# Altium schematic sheet BV100011_ControlIRS485.SchDoc
size B
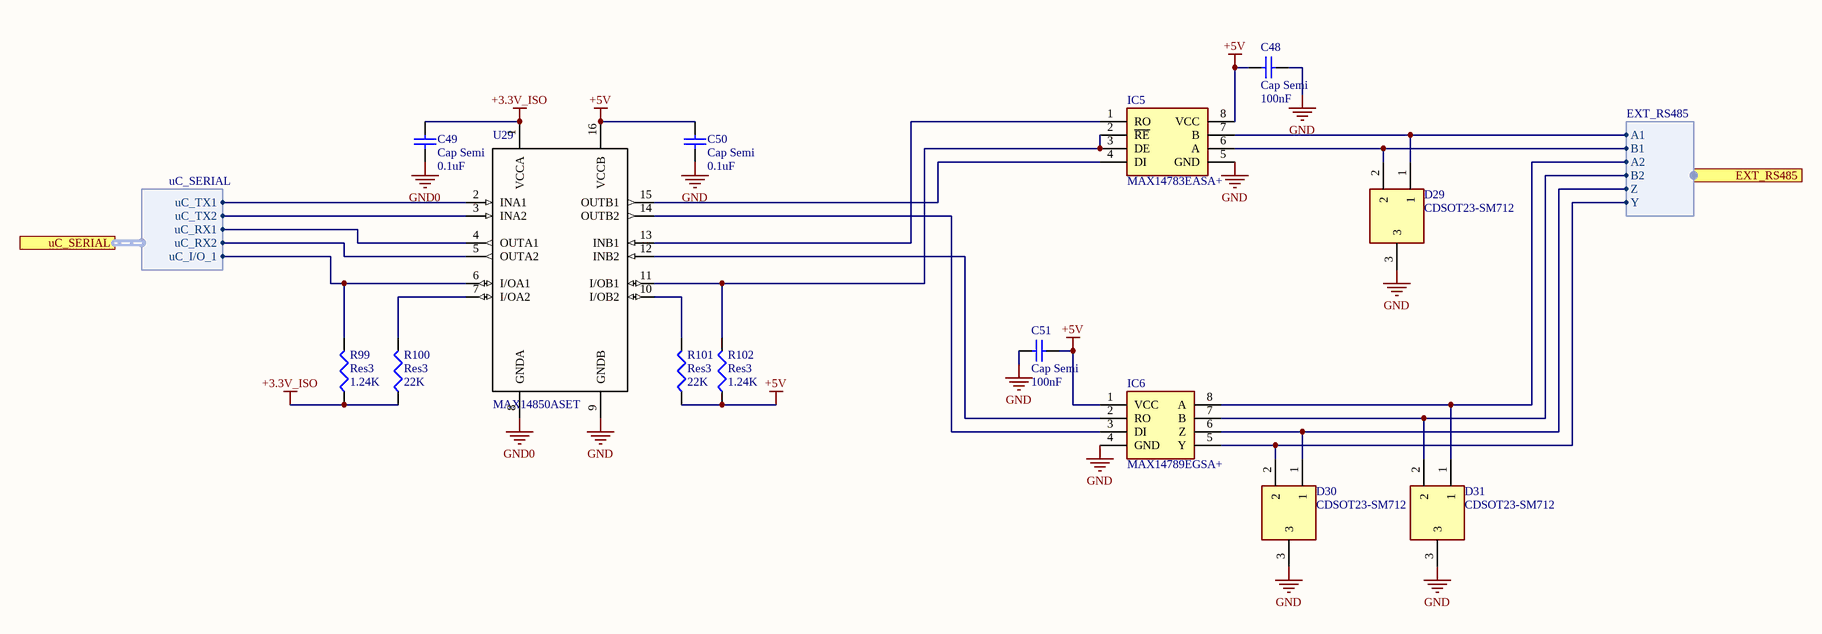
[diagram p0: BV100011_ControlIRS485.SchDoc]

## Parts
C48  Cap Semi  value 100nF  [C1206]
C49  Cap Semi  value 0.1uF  [C1206]
C50  Cap Semi  value 0.1uF  [C1206]
C51  Cap Semi  value 100nF  [C1206]
D29  CDSOT23-SM712  [SOT95P230X117-3N]
D30  CDSOT23-SM712  [SOT95P230X117-3N]
D31  CDSOT23-SM712  [SOT95P230X117-3N]
IC5  MAX14783EASA+  [SOIC127P600X175-8N]
IC6  MAX14789EGSA+  [SOIC127P600X175-8N]
R99  Res3  value 1.24K  [J1-0603]
R100  Res3  value 22K  [J1-0603]
R101  Res3  value 22K  [C1206]
R102  Res3  value 1.24K  [C1206]
U29  MAX14850ASET  [*SOIC127P600X175-16N]

## Ports
EXT_RS485 (harness EXT_RS485), uC_SERIAL (harness uC_SERIAL)

## Harnesses
uC_SERIAL: uC_TX1, uC_TX2, uC_RX1, uC_RX2, uC_I/O_1
EXT_RS485: A1, B1, A2, B2, Z, Y

## Nets
+3.3V_ISO: C49.1 R99.1 R100.1 U29.1(VCCA)
+5V: C48.1 C50.1 C51.2 IC5.8(VCC) IC6.1(VCC) R101.1 R102.1 U29.16(VCCB)
GND: C48.2 C50.2 C51.1 D29.3 D30.3 D31.3 IC5.5(GND) IC6.4(GND) U29.9(GNDB)
GND0: C49.2 U29.8(GNDA)
NetD29_1: D29.1 IC5.7(B) ; port EXT_RS485.A1
NetD29_2: D29.2 IC5.6(A) ; port EXT_RS485.B1
NetD30_1: D30.1 IC6.6(Z) ; port EXT_RS485.Z
NetD30_2: D30.2 IC6.5(Y) ; port EXT_RS485.Y
NetD31_1: D31.1 IC6.8(A) ; port EXT_RS485.A2
NetD31_2: D31.2 IC6.7(B) ; port EXT_RS485.B2
NetIC5_1: IC5.1(RO) U29.13(INB1)
NetIC5_2: IC5.2(~{RE}) IC5.3(DE) R102.2 U29.11(I/OB1)
NetIC5_4: IC5.4(DI) U29.15(OUTB1)
NetIC6_2: IC6.2(RO) U29.12(INB2)
NetIC6_3: IC6.3(DI) U29.14(OUTB2)
NetR99_2: R99.2 U29.6(I/OA1) ; port uC_SERIAL.uC_I/O_1
NetR100_2: R100.2 U29.7(I/OA2)
NetR101_2: R101.2 U29.10(I/OB2)
NetU29_2: U29.2(INA1) ; port uC_SERIAL.uC_TX1
NetU29_3: U29.3(INA2) ; port uC_SERIAL.uC_TX2
NetU29_4: U29.4(OUTA1) ; port uC_SERIAL.uC_RX1
NetU29_5: U29.5(OUTA2) ; port uC_SERIAL.uC_RX2

## Library data of the parts
C48-C51 = Cap Semi: Capacitor (Semiconductor SIM Model); Published: 8-Jun-2000; LatestRevisionDate: 29-May-2009; LatestRevisionNote: IPC-7351 Footprint Added.; PackageReference: C1206; Publisher: Altium Limited; PackageDescription: Chip Capacitor
D29-D31 = CDSOT23-SM712: Diode; Manufacturer_Name: Bourns; Allied_Number: 70154680; Datasheet Link: http://uk.rs-online.com/web/p/products/7673728; Height: 1.17mm; Manufacturer_Part_Number: CDSOT23-SM712; Mouser Part Number: 652-CDSOT23-SM712; Mouser Price/Stock: https://www.mouser.com/Search/Refine.aspx?Keyword=652-CDSOT23-SM712; RS Part Number: 7673728P; RS Price/Stock: http://uk.rs-online.com/web/p/products/7673728P; Allied Price/Stock: https://www.alliedelec.com/bourns-cdsot23-sm712/70154680/
IC5 = MAX14783EASA+: Integrated Circuit; Manufacturer_Name: Maxim Integrated; Datasheet Link: https://datasheets.maximintegrated.com/en/ds/MAX14783E.pdf; Height: 1.75mm; Manufacturer_Part_Number: MAX14783EASA+; Mouser Part Number: 700-MAX14783EASA+; Mouser Price/Stock: https://www.mouser.com/Search/Refine.aspx?Keyword=700-MAX14783EASA%2B
IC6 = MAX14789EGSA+: Integrated Circuit; Manufacturer_Name: Maxim Integrated; Datasheet Link: https://datasheets.maximintegrated.com/en/ds/MAX14784E-MAX14789E.pdf; Height: 1.75mm; Manufacturer_Part_Number: MAX14789EGSA+; Mouser Part Number: 700-MAX14789EGSA+; Mouser Price/Stock: https://www.mouser.com/Search/Refine.aspx?Keyword=700-MAX14789EGSA%2B
R99-R102 = Res3: Resistor; Published: 8-Jun-2000; LatestRevisionDate: 29-May-2009; LatestRevisionNote: IPC-7351 Footprint Added.; PackageReference: J1-0603; Publisher: Altium Limited; PackageDescription: Chip Resistor
U29 = MAX14850ASET: Digital Isolator, 6-Ch, 30ns, Nsoic-16; MF: Maxim Integrated; MP: MAX14850ASE+; SnapEDA_Link: https://www.snapeda.com/parts/MAX14850ASE%2B/Maxim%20Integrated/view-part/?ref=snap; Availability: Unavailable; Price: None; Package: SOIC-16 Maxim; Value: *